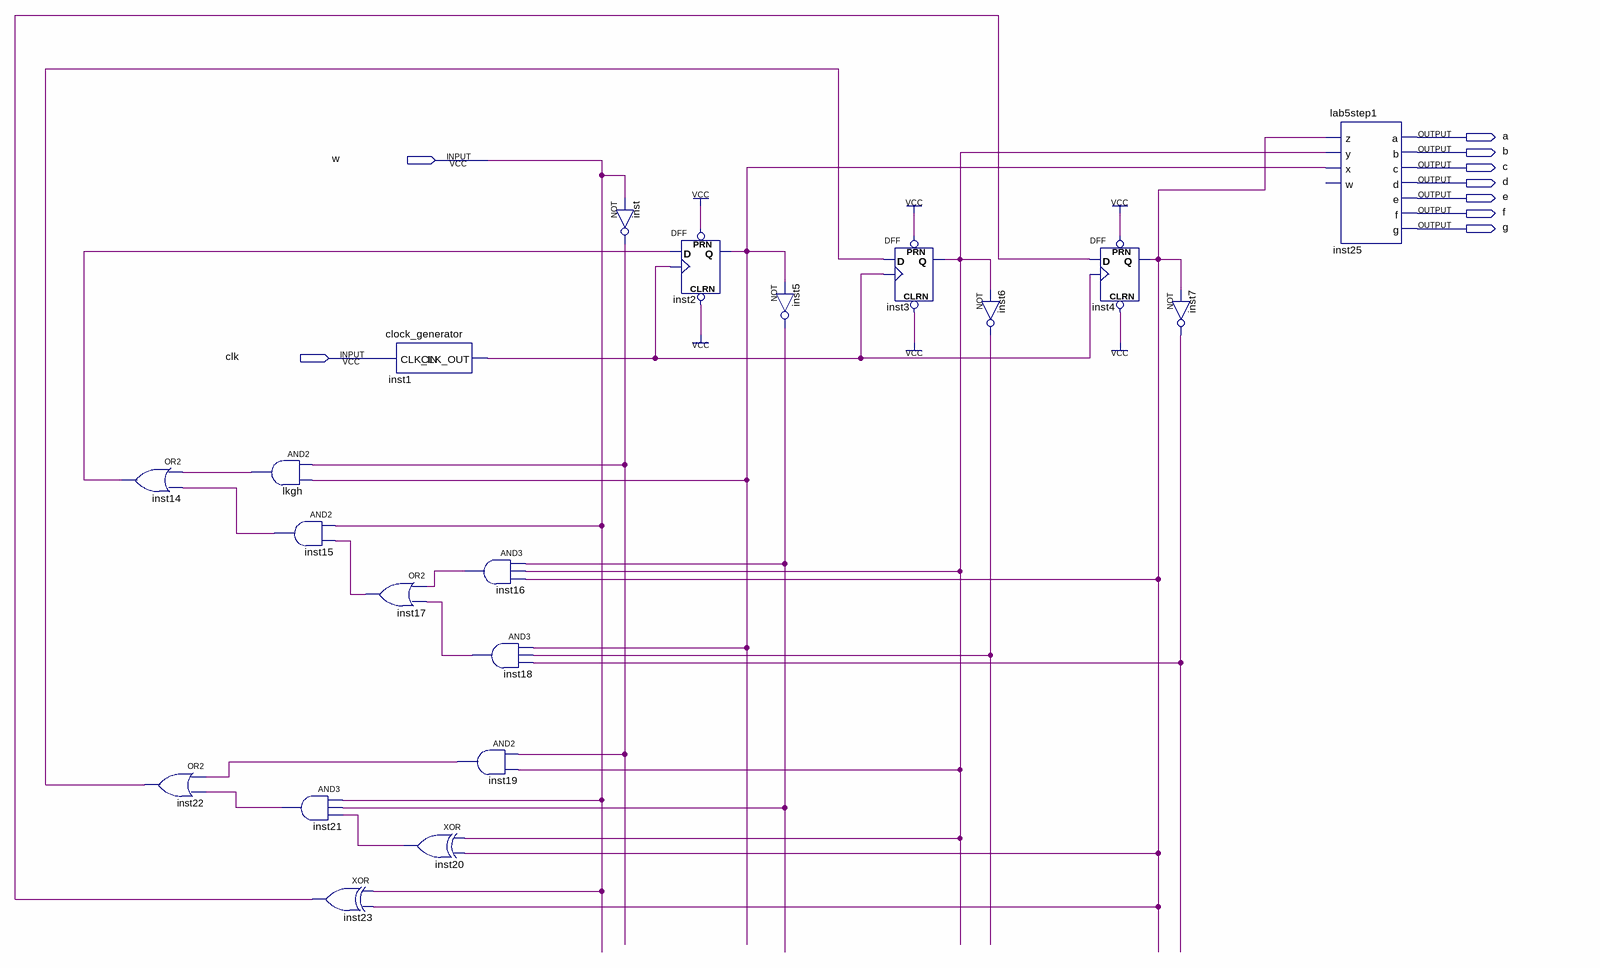
[diagram p0: schematic sheet]
// Quartus schematic Lab11step1.bdf as structural Verilog: 20 symbols, 9 pins
module Lab11step1 (
  input  w,
  input  clk,
  output a,
  output b,
  output c,
  output d,
  output e,
  output f,
  output g
);

  wire inst1_clk_out, inst2_q, inst3_q, inst4_q, inst5_out, inst6_out, inst7_out, inst14_out, inst15_out,
       inst16_out, inst17_out, inst18_out, inst19_out, inst20_out, inst21_out, inst22_out, inst23_out,
       inst_out, lkgh_out;

  or inst14 (inst14_out, lkgh_out, inst15_out);
  or inst22 (inst22_out, inst19_out, inst21_out);
  and lkgh (lkgh_out, inst_out, inst2_q);
  and inst15 (inst15_out, w, inst17_out);
  and inst21 (inst21_out, w, inst5_out, inst20_out);
  xor inst23 (inst23_out, w, inst4_q);
  or inst17 (inst17_out, inst16_out, inst18_out);
  clock_generator inst1 (.CLK_IN(clk), .CLK_OUT(inst1_clk_out));
  xor inst20 (inst20_out, inst3_q, inst4_q);
  and inst16 (inst16_out, inst5_out, inst3_q, inst4_q);
  and inst18 (inst18_out, inst2_q, inst6_out, inst7_out);
  and inst19 (inst19_out, inst_out, inst3_q);
  not inst (inst_out, w);
  DFF inst2 (.CLRN(1'b1), .CLK(inst1_clk_out), .D(inst14_out), .PRN(1'b1), .Q(inst2_q));
  not inst5 (inst5_out, inst2_q);
  DFF inst3 (.CLRN(1'b1), .CLK(inst1_clk_out), .D(inst22_out), .PRN(1'b1), .Q(inst3_q));
  not inst6 (inst6_out, inst3_q);
  DFF inst4 (.CLRN(1'b1), .CLK(inst1_clk_out), .D(inst23_out), .PRN(1'b1), .Q(inst4_q));
  not inst7 (inst7_out, inst4_q);
  lab5step1 inst25 (.z(inst4_q), .x(inst2_q), .y(inst3_q), .a(a), .b(b), .c(c), .d(d), .e(e), .f(f), .g(g));  // open: w
endmodule
